# Altium schematic sheet P09_USB HOST_USB OTG.SchDoc
size 594 x 420 mm
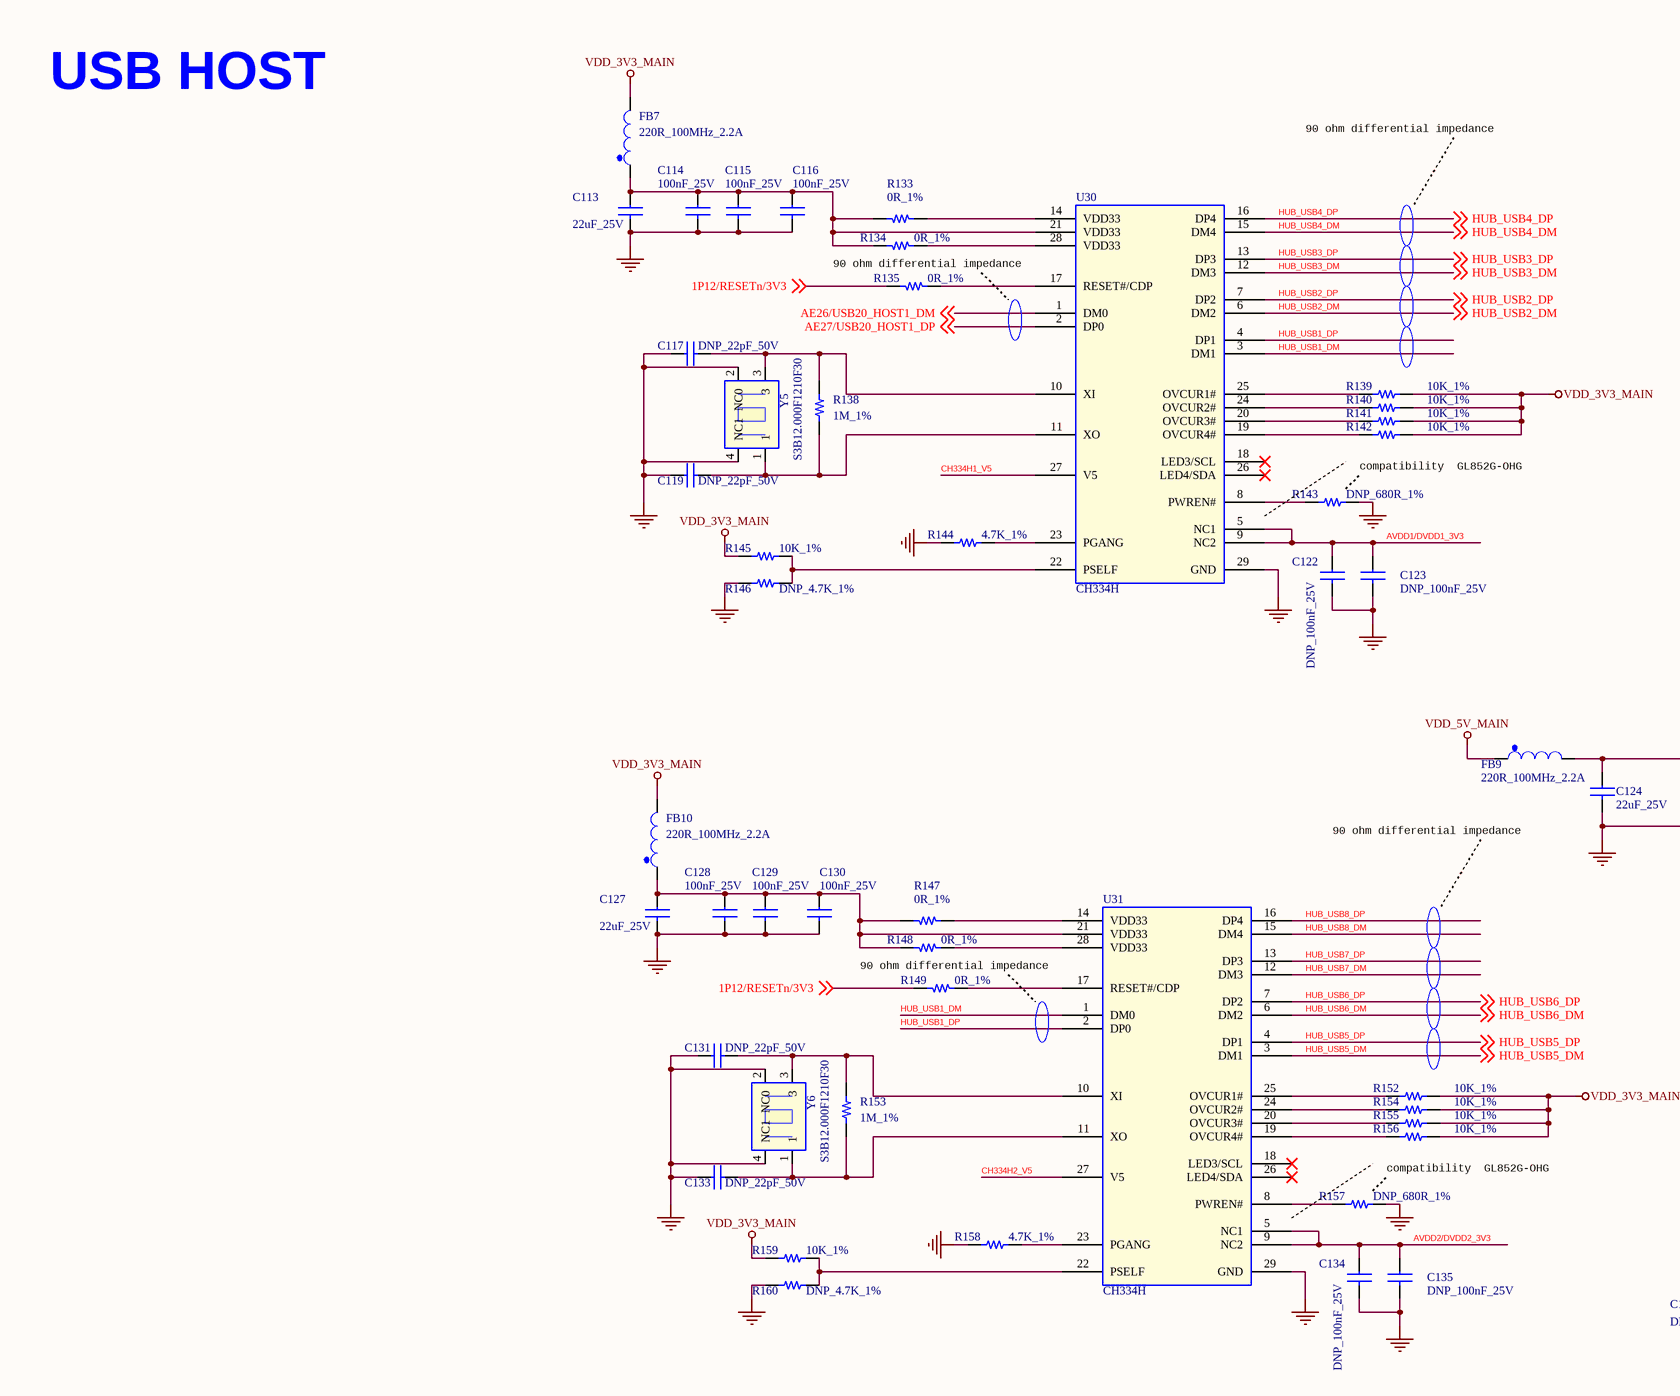
[diagram p0: P09_USB HOST_USB OTG.SchDoc, top left]
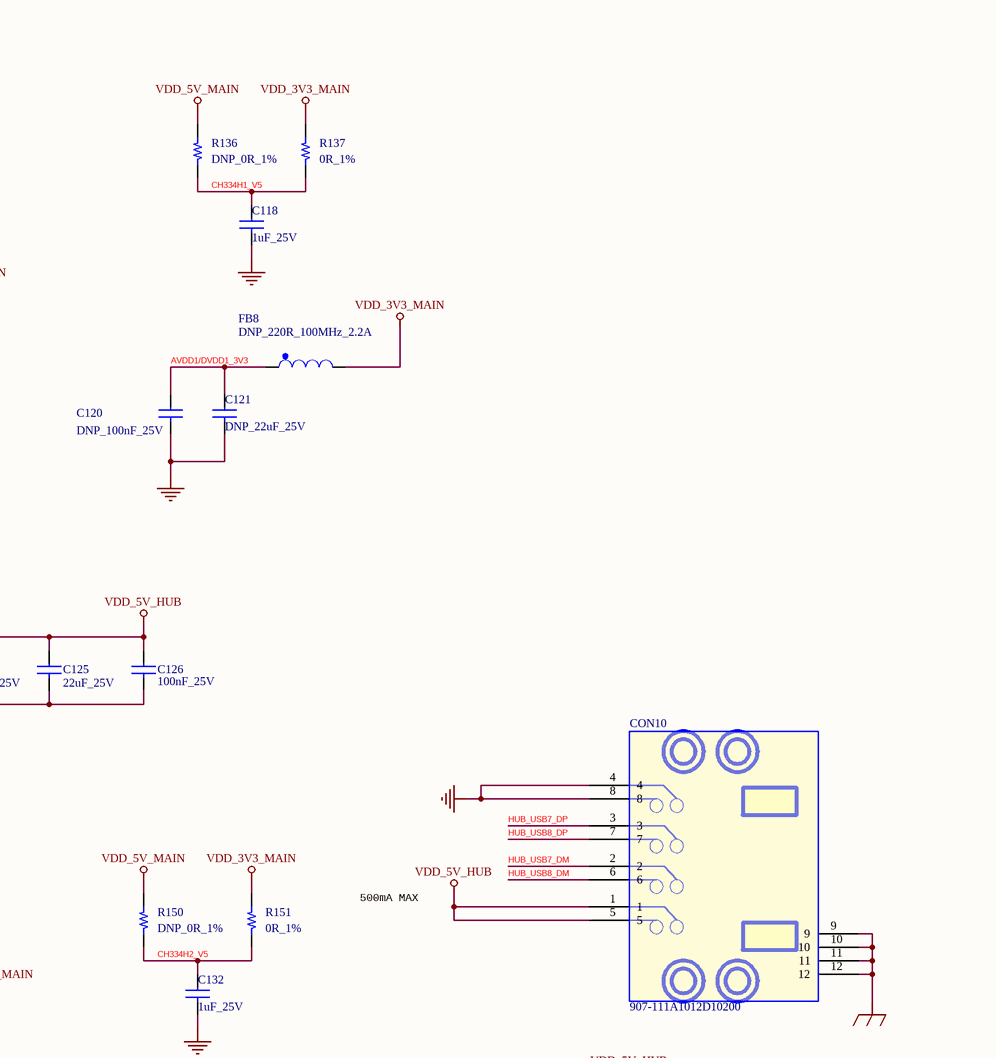
[diagram p1: P09_USB HOST_USB OTG.SchDoc, top right]
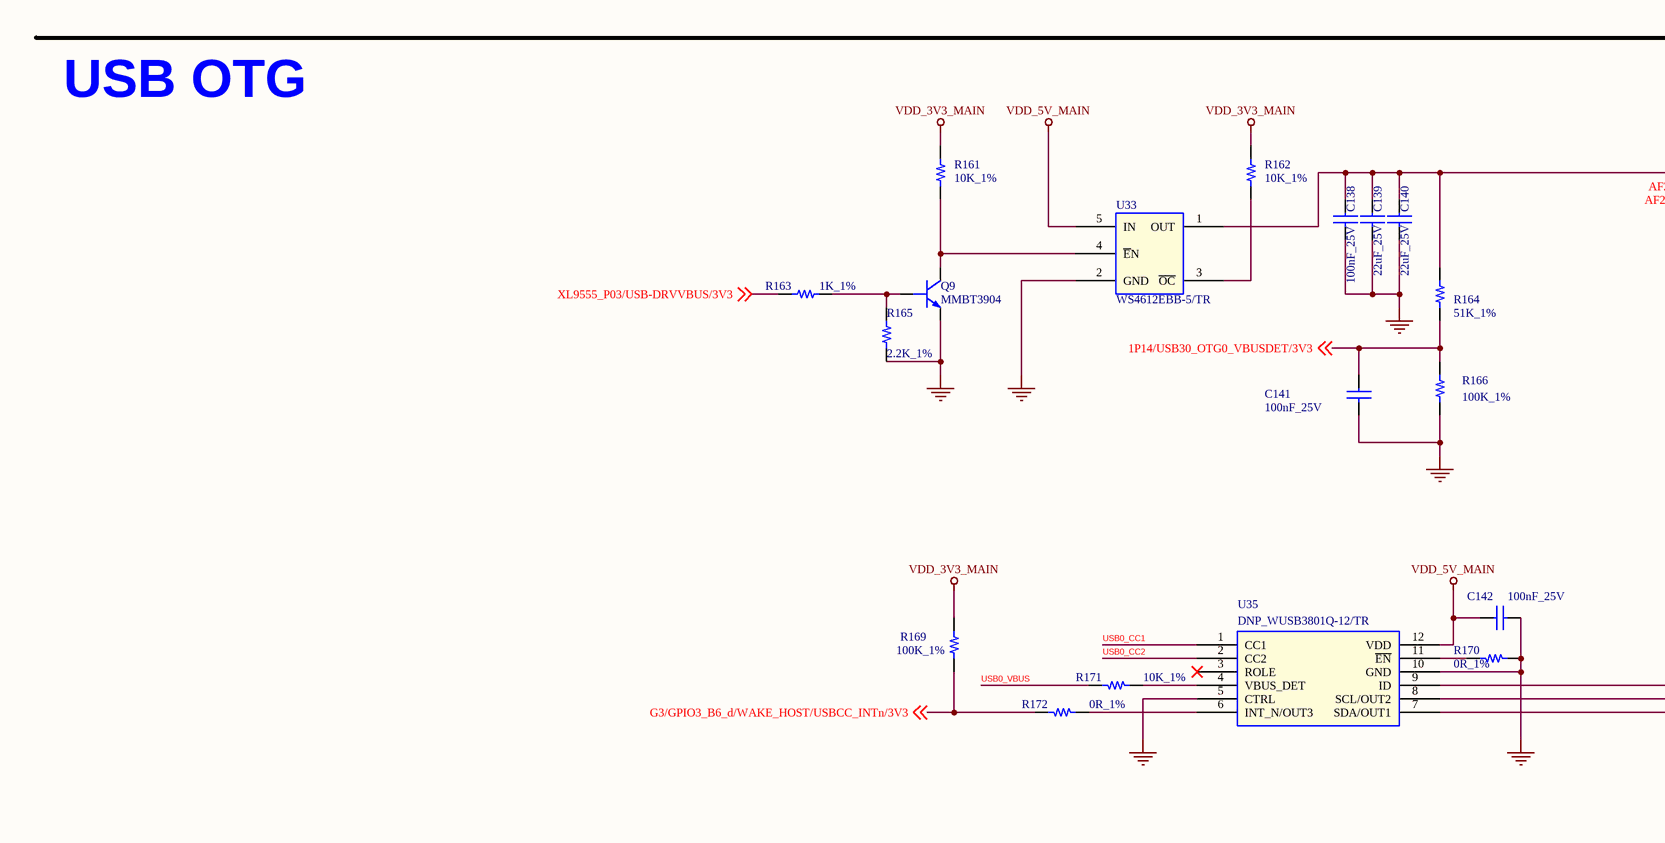
[diagram p2: P09_USB HOST_USB OTG.SchDoc, bottom left]
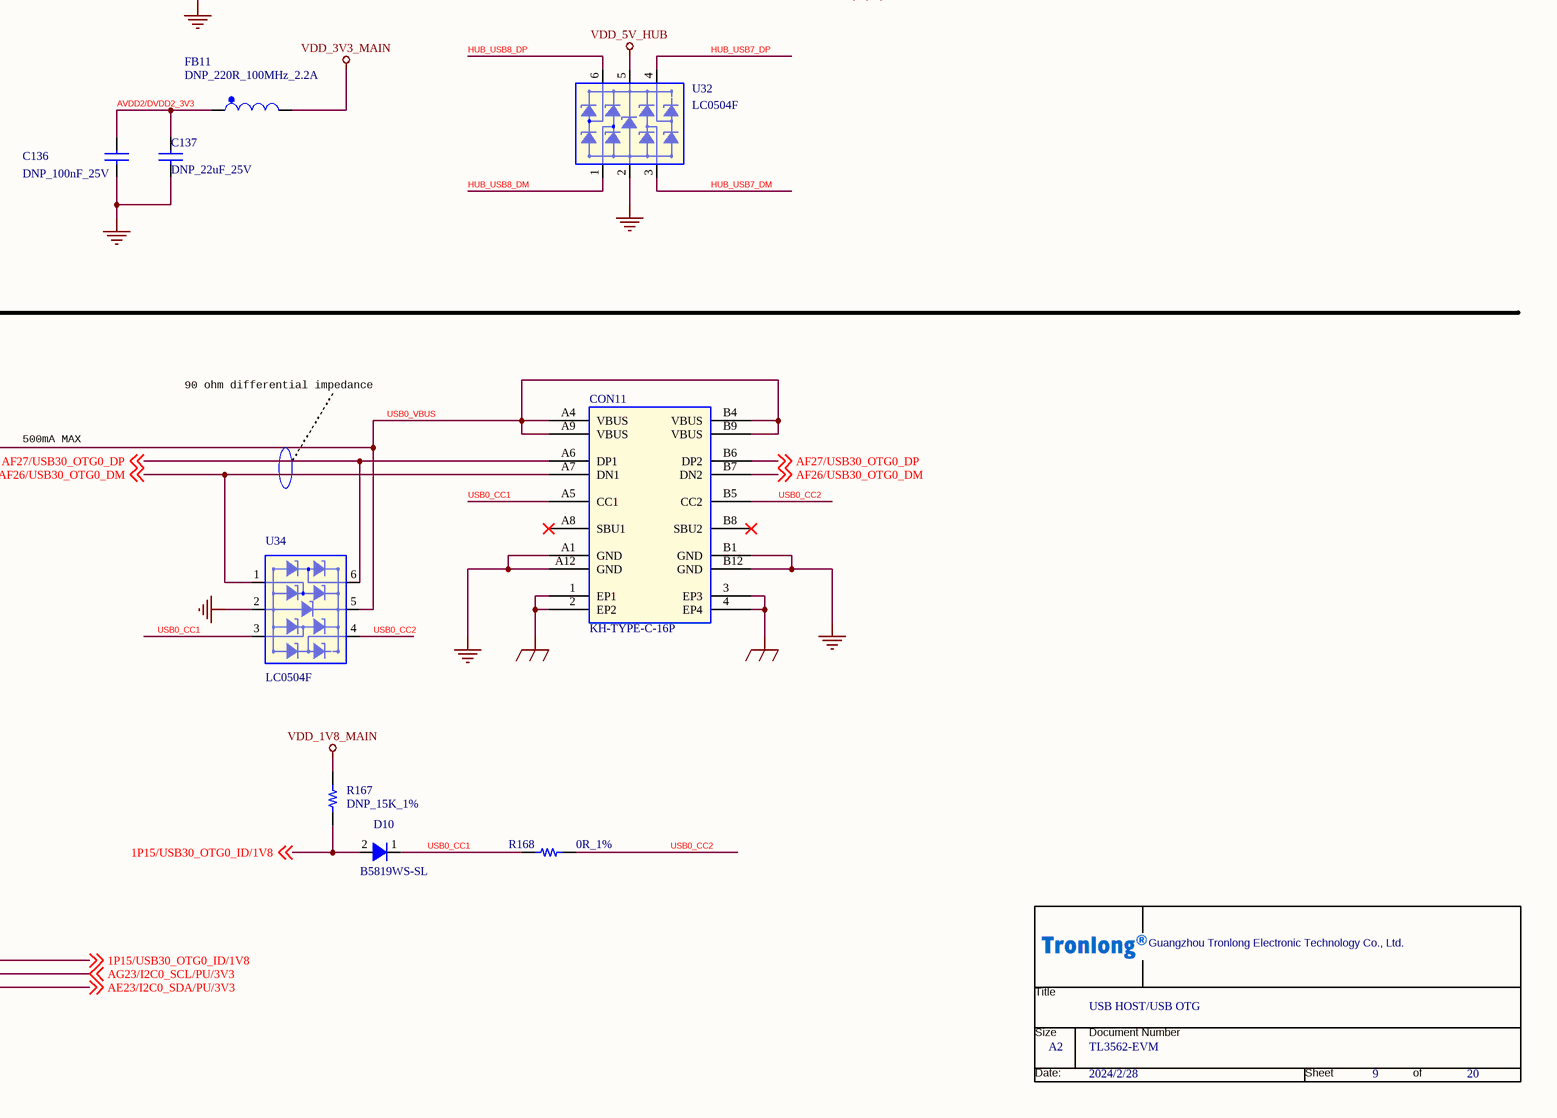
[diagram p3: P09_USB HOST_USB OTG.SchDoc, bottom right]

## Parts
*  Page Count: 20  Page Number: 9  Page Size: A2  OrgName: Guangzhou Tronlong Electronic Technology Co., Ltd.  Title: USB HOST/USB OTG  Doc: TL3562-EVM  Page Modify Date: 2024/2/28  (hidden comment: Tronlong_TITTLE_20211115)  (graphical)
C113  22uF_25V  [C0805]
C114  100nF_25V  [C0402]
C115  100nF_25V  [C0402]
C116  100nF_25V  [C0402]
C117  DNP_22pF_50V  [C0603]
C118  1uF_25V  [C0603]
C119  DNP_22pF_50V  [C0603]
C120  DNP_100nF_25V  [C0402]
C121  DNP_22uF_25V  [C0805]
C122  DNP_100nF_25V  [C0402]
C123  DNP_100nF_25V  [C0402]
C124  22uF_25V  [C0805]
C125  22uF_25V  [C0805]
C126  100nF_25V  [C0402]
C127  22uF_25V  [C0805]
C128  100nF_25V  [C0402]
C129  100nF_25V  [C0402]
C130  100nF_25V  [C0402]
C131  DNP_22pF_50V  [C0603]
C132  1uF_25V  [C0603]
C133  DNP_22pF_50V  [C0603]
C134  DNP_100nF_25V  [C0402]
C135  DNP_100nF_25V  [C0402]
C136  DNP_100nF_25V  [C0402]
C137  DNP_22uF_25V  [C0805]
C138  100nF_25V  [C0402]
C139  22uF_25V  [C0805]
C140  22uF_25V  [C0805]
C141  100nF_25V  [C0402]
C142  100nF_25V  [C0402]
CON10  907-111A1012D10200  [CON_USBA_DUAL]
CON11  KH-TYPE-C-16P  [TYPE-C_16P_90_SMD]
D10  B5819WS-SL  [SOD-323]
FB7  220R_100MHz_2.2A  [L0603]
FB8  DNP_220R_100MHz_2.2A  [L0603]
FB9  220R_100MHz_2.2A  [L0603]
FB10  220R_100MHz_2.2A  [L0603]
FB11  DNP_220R_100MHz_2.2A  [L0603]
Q9  MMBT3904  [SOT23-3_DBZ3]
R133  0R_1%  [R0402]
R134  0R_1%  [R0402]
R135  0R_1%  [R0402]
R136  DNP_0R_1%  [R0603]
R137  0R_1%  [R0603]
R138  1M_1%  [R0603]
R139  10K_1%  [R0402]
R140  10K_1%  [R0402]
R141  10K_1%  [R0402]
R142  10K_1%  [R0402]
R143  DNP_680R_1%  [R0603]
R144  4.7K_1%  [R0402]
R145  10K_1%  [R0402]
R146  DNP_4.7K_1%  [R0402]
R147  0R_1%  [R0402]
R148  0R_1%  [R0402]
R149  0R_1%  [R0402]
R150  DNP_0R_1%  [R0603]
R151  0R_1%  [R0603]
R152  10K_1%  [R0402]
R153  1M_1%  [R0603]
R154  10K_1%  [R0402]
R155  10K_1%  [R0402]
R156  10K_1%  [R0402]
R157  DNP_680R_1%  [R0603]
R158  4.7K_1%  [R0402]
R159  10K_1%  [R0402]
R160  DNP_4.7K_1%  [R0402]
R161  10K_1%  [R0402]
R162  10K_1%  [R0402]
R163  1K_1%  [R0402]
R164  51K_1%  [R0402]
R165  2.2K_1%  [R0603]
R166  100K_1%  [R0402]
R167  DNP_15K_1%  [R0402]
R168  0R_1%  [R0402]
R169  100K_1%  [R0402]
R170  0R_1%  [R0402]
R171  10K_1%  [R0402]
R172  0R_1%  [R0402]
U30  CH334H  [QFN28_5x5]
U31  CH334H  [QFN28_5x5]
U32  LC0504F  [SOT363]
U33  WS4612EBB-5/TR  [SOT23-5]
U34  LC0504F  [SOT363]
U35  DNP_WUSB3801Q-12/TR  [QFN1616-12L]
Y5  S3B12.000F1210F30  [SMD_3225]
Y6  S3B12.000F1210F30  [SMD_3225]

## Nets
EGND: CON10.9 CON10.10 CON10.11 CON10.12 CON11.1(EP1) CON11.2(EP2) CON11.3(EP3) CON11.4(EP4)
GND: C113.2 C114.2 C115.2 C116.2 C117.1 C118.2 C119.1 C120.2 C121.2 C122.2 C123.2 C124.2 C125.2 C126.2 C127.2 C128.2 C129.2 C130.2 C131.1 C132.2 C133.1 C134.2 C135.2 C136.2 C137.2 C138.2 C139.2 C140.2 C141.2 C142.2 CON10.4 CON10.8 CON11.A1(GND) CON11.A12(GND) CON11.B1(GND) CON11.B12(GND) Q9.2(E) R143.2 R144.2 R146.2 R157.2 R158.2 R160.2 R165.1 R166.1 R170.1 U30.29(GND) U31.29(GND) U32.2 U33.2(GND) U34.2 U35.5(CTRL) U35.10(GND) Y5.2(NC0) Y5.4(NC1) Y6.2(NC0) Y6.4(NC1)
VDD_1V8_MAIN: R167.1
VDD_3V3_MAIN: FB7.2 FB8.2 FB10.2 FB11.2 R137.2 R139.2 R140.2 R141.2 R142.2 R145.1 R151.2 R152.2 R154.2 R155.2 R156.2 R159.1 R161.1 R162.2 R169.1
VDD_5V_HUB: C124.1 C125.1 C126.1 CON10.1 CON10.5 FB9.2 U32.5
VDD_5V_MAIN: C142.1 FB9.1 R136.2 R150.2 U33.5(IN) U35.12(VDD)
1P12/RESETn/3V3: R135.2 R149.2 ; off-sheet 1P12/RESETn/3V3
1P14/USB30_OTG0_VBUSDET/3V3: C141.1 R164.1 R166.2 ; off-sheet 1P14/USB30_OTG0_VBUSDET/3V3
1P15/USB30_OTG0_ID/1V8: D10.2(Cathode) R167.2 U35.9(ID) ; off-sheet 1P15/USB30_OTG0_ID/1V8
AE23/I2C0_SDA/PU/3V3: U35.7(SDA/OUT1) ; off-sheet AE23/I2C0_SDA/PU/3V3
AE26/USB20_HOST1_DM: U30.1(DM0) ; off-sheet AE26/USB20_HOST1_DM
AE27/USB20_HOST1_DP: U30.2(DP0) ; off-sheet AE27/USB20_HOST1_DP
AF26/USB30_OTG0_DM: CON11.A7(DN1) CON11.B7(DN2) U34.1 ; off-sheet AF26/USB30_OTG0_DM
AF27/USB30_OTG0_DP: CON11.A6(DP1) CON11.B6(DP2) U34.6 ; off-sheet AF27/USB30_OTG0_DP
AG23/I2C0_SCL/PU/3V3: U35.8(SCL/OUT2) ; off-sheet AG23/I2C0_SCL/PU/3V3
AVDD1/DVDD1_3V3: C120.1 C121.1 C122.1 C123.1 FB8.1 U30.5(NC1) U30.9(NC2)
AVDD2/DVDD2_3V3: C134.1 C135.1 C136.1 C137.1 FB11.1 U31.5(NC1) U31.9(NC2)
CH334H1_V5: C118.1 R136.1 R137.1 U30.27(V5)
CH334H2_V5: C132.1 R150.1 R151.1 U31.27(V5)
G3/GPIO3_B6_d/WAKE_HOST/USBCC_INTn/3V3: R169.2 R172.2 ; off-sheet G3/GPIO3_B6_d/WAKE_HOST/USBCC_INTn/3V3
HUB_USB1_DM: U30.3(DM1) U31.1(DM0)
HUB_USB1_DP: U30.4(DP1) U31.2(DP0)
HUB_USB2_DM: U30.6(DM2) ; off-sheet HUB_USB2_DM
HUB_USB2_DP: U30.7(DP2) ; off-sheet HUB_USB2_DP
HUB_USB3_DM: U30.12(DM3) ; off-sheet HUB_USB3_DM
HUB_USB3_DP: U30.13(DP3) ; off-sheet HUB_USB3_DP
HUB_USB4_DM: U30.15(DM4) ; off-sheet HUB_USB4_DM
HUB_USB4_DP: U30.16(DP4) ; off-sheet HUB_USB4_DP
HUB_USB5_DM: U31.3(DM1) ; off-sheet HUB_USB5_DM
HUB_USB5_DP: U31.4(DP1) ; off-sheet HUB_USB5_DP
HUB_USB6_DM: U31.6(DM2) ; off-sheet HUB_USB6_DM
HUB_USB6_DP: U31.7(DP2) ; off-sheet HUB_USB6_DP
HUB_USB7_DM: CON10.2 U31.12(DM3) U32.3
HUB_USB7_DP: CON10.3 U31.13(DP3) U32.4
HUB_USB8_DM: CON10.6 U31.15(DM4) U32.1
HUB_USB8_DP: CON10.7 U31.16(DP4) U32.6
USB0_CC1: CON11.A5(CC1) D10.1(Anode) R168.2 U34.3 U35.1(CC1)
USB0_CC2: CON11.B5(CC2) R168.1 U34.4 U35.2(CC2)
USB0_VBUS: C138.1 C139.1 C140.1 CON11.A4(VBUS) CON11.A9(VBUS) CON11.B4(VBUS) CON11.B9(VBUS) R164.2 R171.2 U33.1(OUT) U34.5
XL9555_P03/USB-DRVVBUS/3V3: R163.2 ; off-sheet XL9555_P03/USB-DRVVBUS/3V3
NetC113_1: C113.1 C114.1 C115.1 C116.1 FB7.1 R133.1 R134.1 U30.21(VDD33)
NetC117_2: C117.2 R138.1 U30.10(XI) Y5.3
NetC119_2: C119.2 R138.2 U30.11(XO) Y5.1
NetC127_1: C127.1 C128.1 C129.1 C130.1 FB10.1 R147.1 R148.1 U31.21(VDD33)
NetC131_2: C131.2 R153.1 U31.10(XI) Y6.3
NetC133_2: C133.2 R153.2 U31.11(XO) Y6.1
NetQ9_1: Q9.1(B) R163.1 R165.2
NetQ9_3: Q9.3(C) R161.2 U33.4(~{E}N)
NetR133_2: R133.2 U30.14(VDD33)
NetR134_2: R134.2 U30.28(VDD33)
NetR135_1: R135.1 U30.17(RESET#/CDP)
NetR139_1: R139.1 U30.25(OVCUR1#)
NetR140_1: R140.1 U30.24(OVCUR2#)
NetR141_1: R141.1 U30.20(OVCUR3#)
NetR142_1: R142.1 U30.19(OVCUR4#)
NetR143_1: R143.1 U30.8(PWREN#)
NetR144_1: R144.1 U30.23(PGANG)
NetR145_2: R145.2 R146.1 U30.22(PSELF)
NetR147_2: R147.2 U31.14(VDD33)
NetR148_2: R148.2 U31.28(VDD33)
NetR149_1: R149.1 U31.17(RESET#/CDP)
NetR152_1: R152.1 U31.25(OVCUR1#)
NetR154_1: R154.1 U31.24(OVCUR2#)
NetR155_1: R155.1 U31.20(OVCUR3#)
NetR156_1: R156.1 U31.19(OVCUR4#)
NetR157_1: R157.1 U31.8(PWREN#)
NetR158_1: R158.1 U31.23(PGANG)
NetR159_2: R159.2 R160.1 U31.22(PSELF)
NetR162_1: R162.1 U33.3(~{OC})
NetR170_2: R170.2 U35.11(~{EN})
NetR171_1: R171.1 U35.4(VBUS_DET)
NetR172_1: R172.1 U35.6(INT_N/OUT3)

Not connected (* = marked no-connect by the designer): CON11 A8(SBU1)* B8(SBU2)*; U30 18(LED3/SCL)* 26(LED4/SDA)*; U31 18(LED3/SCL)* 26(LED4/SDA)*; U35 3(ROLE)*

## Notes on the sheet
- USB HOST
- 90 ohm differential impedance
- compatibility  GL852G-OHG
- 500mA MAX
- USB OTG
- (in symbol Tronlong_TITTLE_20211115) Title; Size; Document Number; Date:; Sheet; of

## Library data of the parts
* = Tronlong_TITTLE_20211115: RevCode: A?; Page Create Date: March  8, 1995
C113 = CAP NP_Dup3: 贴片陶瓷电容,22uF,20%,25V,X5R; Manufacturer Character: 中国大陆; room: USB HUB; Operation Temperature（℃）: -55~85℃; As-Welded: /; Temperature: -55~125℃; PCB Footprint: C0805
C114 C116 C129 = CAP NP_Dup3: 贴片陶瓷电容,100nF,10%,25V,X5R; Manufacturer Character: 中国大陆; As-Welded: /; Operation Temperature（℃）: -55~85℃; room: USB HUB; Temperature: -55~125℃; PCB Footprint: C0402
C115 C126 C128 C130 = CAP NP_Dup3: 贴片陶瓷电容,100nF,10%,25V,X5R; Manufacturer Character: 中国大陆; As-Welded: /; room: USB HUB; Operation Temperature（℃）: -55~85℃; Temperature: -55~125℃; PCB Footprint: C0402
C117 C119 = CAP NP_Dup3: 贴片陶瓷电容,22pF,5%,50V,COG; Manufacturer Character: 中国大陆; Operation Temperature（℃）: -55~125℃; As-Welded: DNP; room: USB HUB; Temperature: -55~125℃; PCB Footprint: C0603
C118 C132 = CAP NP_Dup3: 贴片陶瓷电容,1uF,10%,25V,X5R; Manufacturer Character: 中国大陆; As-Welded: /; Operation Temperature（℃）: -55~85℃; room: USB HUB; PCB Footprint: C0603
C120 C122 C136 = CAP NP_Dup3: 100nF,10%,C0402,25V; Manufacturer Character: 中国大陆; Operation Temperature（℃）: -40~85℃; As-Welded: DNP; room: USB HUB; Temperature: -55~125℃; PCB Footprint: C0402
C121 = CAP NP_Dup3: 贴片陶瓷电容,22uF,10%,16V,X5R; Manufacturer Character: 中国大陆; room: USB HUB; As-Welded: DNP; Operation Temperature（℃）: -55~85℃; Temperature: -55~125℃; PCB Footprint: C0805
C123 C134 C135 = CAP NP_Dup3: 100nF,10%,C0402,25V; Manufacturer Character: 中国大陆; room: USB HUB; As-Welded: DNP; Operation Temperature（℃）: -40~85℃; Temperature: -55~125℃; PCB Footprint: C0402
C124 C125 C127 = CAP NP_Dup3: 贴片陶瓷电容,22uF,20%,25V,X5R; Manufacturer Character: 中国大陆; Operation Temperature（℃）: -55~85℃; room: USB HUB; As-Welded: /; Temperature: -55~125℃; PCB Footprint: C0805
C131 C133 = CAP NP_Dup3: 贴片陶瓷电容,22pF,5%,50V,COG; Manufacturer Character: 中国大陆; room: USB HUB; As-Welded: DNP; Operation Temperature（℃）: -55~125℃; Temperature: -55~125℃; PCB Footprint: C0603
C137 = CAP NP_Dup3: 贴片陶瓷电容,22uF,10%,16V,X5R; Manufacturer Character: 中国大陆; Operation Temperature（℃）: -55~85℃; As-Welded: DNP; room: USB HUB; Temperature: -55~125℃; PCB Footprint: C0805
C138 = CAP NP_Dup1: 贴片陶瓷电容,100nF,10%,25V,X5R; Manufacturer Character: 中国大陆; As-Welded: /; Operation Temperature（℃）: -55~85℃; room: DRDUSB; Temperature: -55~125℃; PCB Footprint: C0402
C139 C140 = CAP NP_Dup1: 贴片陶瓷电容,22uF,20%,25V,X5R; Manufacturer Character: 中国大陆; Operation Temperature（℃）: -55~85℃; room: DRDUSB; As-Welded: /; Temperature: -55~125℃; PCB Footprint: C0805
C141 = CAP NP_Dup1: 贴片陶瓷电容,100nF,10%,25V,X5R; Manufacturer Character: 中国大陆; Operation Temperature（℃）: -55~85℃; As-Welded: /; room: DRDUSB; Temperature: -55~125℃; PCB Footprint: C0402
C142 = CAP NP_Dup1: 贴片陶瓷电容,100nF,10%,25V,X5R; Manufacturer Character: 中国大陆; As-Welded: /; Operation Temperature（℃）: -55~85℃; room: USB HUB; Temperature: -55~125℃; PCB Footprint: C0402
CON10 = DOUBLE USB A TYPE: USB-A-双层座,8PIN,90度,母座,插件; Manufacturer PartNumber: FUS208-FDBW3K; Manufacturer: 深圳特思嘉工业电子有限公司（TXGA）; Manufacturer Character: 中国大陆; Operation Temperature（℃）: -40~85℃; room: USB HUB; As-Welded: /; PCB Footprint: CON_USBA_DUAL
CON11 = usb 3_0.0 type-c female: Type-C 母座 90度 16 Pin; Manufacturer Character: 中国大陆; Manufacturer: 深圳市金航标电子有限公司(kinghelm); Operation Temperature（℃）: -40~85℃; room: 10; As-Welded: /; PCB Footprint: TYPE-C_16P_90_SMD; Manufacturer PartNumber: KH-TYPE-C-16P
D10 = Diode200mA250V_2: 肖特基二极管,VR=40V,IF=1A,VF=0.6V@1A; TIIntPartnumber: 1E0013; MfrNum: MMSD103T1G; Mfr: On Semiconductor; Manufacturer Character: 中国大陆; Manufacturer: 江苏长晶科技有限公司（JSCJ）; DescriptiveText: Diode 200mA 250V 1.25V Forward Drop; PCB Footprint: smd123; Cost10K: 0.07; Cost100: 0.23; Vendor: Digikey; Operation Temperature（℃）: -55~125℃; As-Welded: /; PartName: Diode200mA250V; Descriptive_Text: Diode 200mA 250V 1.25V Forward Drop; Temperature: -40~125℃; Manufacturer PartNumber: B5819WS-SL
FB7 = FERRITE BEAD_Dup1: 磁珠,50mΩ,2.2A,220R@100MHz; Manufacturer Character: 中国大陆; Manufacturer: 深圳顺络电子股份有限公司（Sunlord）; Manufacturer PartNumber: UPZ1608U221-2R2TF; room: USB HUB; Operation Temperature（℃）: -55~125℃; As-Welded: /; PCB Footprint: L0603; Temperature: -55~+125(Ta)
FB8 FB11 = FERRITE BEAD_Dup1: 磁珠,50mΩ,2.2A,220R@100MHz; Manufacturer Character: 中国大陆; Manufacturer: 深圳顺络电子股份有限公司（Sunlord）; Manufacturer PartNumber: UPZ1608U221-2R2TF; room: USB HUB; As-Welded: DNP; Operation Temperature（℃）: -55~125℃; PCB Footprint: L0603; Temperature: -55~125℃
FB9 FB10 = FERRITE BEAD_Dup1: 磁珠,50mΩ,2.2A,220R@100MHz; Manufacturer PartNumber: UPZ1608U221-2R2TF; Manufacturer: 深圳顺络电子股份有限公司（Sunlord）; Manufacturer Character: 中国大陆; Operation Temperature（℃）: -55~125℃; room: USB HUB; As-Welded: /; PCB Footprint: L0603; Temperature: -55~+125(Ta)
Q9 = MMBT3904/SOT: BJT,NPN,Vceo=40V,Ic=200mA,fT=300MHz,PD=200mW; Manufacturer Character: 中国大陆; Manufacturer: 江苏长晶科技有限公司（JSCJ）; Operation Temperature（℃）: -55~150℃; As-Welded: /; Temperature: -55~150℃; Manufacturer PartNumber: MMBT3904; PCB Footprint: SOT23-3_DBZ3
R133-R135 R147-R149 = Resistor_Dup3: 0R,±1%,R0402,≥1/16W; Manufacturer Character: 中国大陆; CLASS: DISCRETE; As-Welded: /; Operation Temperature（℃）: -55~155℃; PCB Footprint: R0402
R136 R150 = Resistor_Dup3: 贴片电阻,0R,±1%,1/10W; Manufacturer Character: 中国大陆; CLASS: DISCRETE; As-Welded: DNP; Operation Temperature（℃）: -55~155℃; PCB Footprint: R0603
R137 R151 = Resistor_Dup3: 0R,±1%,R0603,≥1/10W; Manufacturer Character: 中国大陆; CLASS: DISCRETE; As-Welded: /; Operation Temperature（℃）: -55~155℃; Temperature: –55~155℃; PCB Footprint: R0603
R138 = Resistor_Dup3: 贴片电阻,1M,±1%,1/10W; Manufacturer Character: 中国大陆; CLASS: DISCRETE; As-Welded: /; Operation Temperature（℃）: -55~155℃; room: USB HUB; PCB Footprint: R0603
R139-R142 R145 = Resistor_Dup3: 贴片电阻,10K,±1%,1/16W; Manufacturer Character: 中国大陆; CLASS: DISCRETE; Operation Temperature（℃）: -55~155℃; room: USB HUB; As-Welded: /; Temperature: –55~155℃; PCB Footprint: R0402
R143 = Resistor_Dup3: 贴片电阻,680R,±1%,1/10W; Manufacturer Character: 中国大陆; CLASS: DISCRETE; room: USB HUB; As-Welded: DNP; Operation Temperature（℃）: -55~155℃; Temperature: -55~155℃; PCB Footprint: R0603
R144 R158 = Resistor_Dup3: 贴片电阻,4.7K,±1%,1/16W; Manufacturer Character: 中国大陆; CLASS: DISCRETE; As-Welded: /; Operation Temperature（℃）: -55~155℃; Temperature: -55~155℃; PCB Footprint: R0402
R146 = Resistor_Dup3: 贴片电阻,4.7K,±1%,1/16W; Manufacturer Character: 中国大陆; CLASS: DISCRETE; Operation Temperature（℃）: -55~155℃; As-Welded: DNP; PCB Footprint: R0402; Temperature: -55~155℃
R152 R154-R156 R159 = Resistor_Dup3: 贴片电阻,10K,±1%,1/16W; Manufacturer Character: 中国大陆; CLASS: DISCRETE; room: USB HUB; Operation Temperature（℃）: -55~155℃; As-Welded: /; Temperature: –55~155℃; PCB Footprint: R0402
R153 = Resistor_Dup3: 贴片电阻,1M,±1%,1/10W; Manufacturer Character: 中国大陆; CLASS: DISCRETE; As-Welded: /; room: USB HUB; Operation Temperature（℃）: -55~155℃; PCB Footprint: R0603
R157 = Resistor_Dup3: 贴片电阻,680R,±1%,1/10W; Manufacturer Character: 中国大陆; CLASS: DISCRETE; Operation Temperature（℃）: -55~155℃; As-Welded: DNP; room: USB HUB; Temperature: -55~155℃; PCB Footprint: R0603
R160 = Resistor_Dup3: 贴片电阻,4.7K,±1%,1/16W; Manufacturer Character: 中国大陆; CLASS: DISCRETE; As-Welded: DNP; Operation Temperature（℃）: -55~155℃; PCB Footprint: R0402; Temperature: -55~155℃
R161 = R 1%: 贴片电阻,10K,±1%,1/16W; Manufacturer Character: 中国大陆; Characteristic: 0402 1/16W +/-1%; CLASS: DISCRETE; Operation Temperature（℃）: -55~155℃; As-Welded: /; room: DRDUSB; Temperature: –55~155℃; PCB Footprint: R0402
R162 = R 1%: 贴片电阻,10K,±1%,1/16W; Manufacturer Character: 中国大陆; Characteristic: 0402 1/16W +/-1%; CLASS: DISCRETE; room: DRDUSB; Operation Temperature（℃）: -55~155℃; As-Welded: /; Temperature: –55~155℃; PCB Footprint: R0402
R163 = Resistor_Dup3: 贴片电阻,1K,±1%,1/16W; Manufacturer Character: 中国大陆; CLASS: DISCRETE; Operation Temperature（℃）: -55~155℃; As-Welded: /; PCB Footprint: R0402
R164 = R 1%: 贴片电阻,51K,±1%,1/16W; Manufacturer Character: 中国大陆; Mistral Part No: 110009031036-R; Mfr_name: PANASONIC-ECG; Mfr_part_number: ERJ-2RNF6981V; Part_type: RESISTORS\FIXED; Characteristic: 0402 1/16W +/-1%; CLASS: DISCRETE; Operation Temperature（℃）: -55~155℃; Project: TELEMETRY ENCODER; Customs_HS_Code: 85332119; Custom_Duty: 15%; As-Welded: /; Temperature: -55~155℃; Tolerance: 1%; Package: 0402; Distributor_name: NA; Distributor_part_number: NA; Height: 0.40MM; Datasheet: Y:\MIS_DATABASE\DATASHEETS\RESISTORS\PAN_ERJ.PDF; Crtd /date: MAZHAR/090807; PCB Footprint: R0402
R165 = Resistor_Dup3: 贴片电阻,2.2K,±1%,1/10W; Manufacturer Character: 中国大陆; CLASS: DISCRETE; As-Welded: /; Operation Temperature（℃）: -55~155℃; PCB Footprint: R0603
R166 = R 1%: 贴片电阻,100K,±1%,1/16W; Manufacturer Character: 中国大陆; Characteristic: 0402 1/16W +/-1%; CLASS: DISCRETE; Operation Temperature（℃）: -55~155℃; As-Welded: /; room: USB HUB; PCB Footprint: R0402; Temperature: -55~155℃
R167 = R 1%: 贴片电阻,15K,±1%,1/16W; Manufacturer Character: 中国大陆; Characteristic: 0402 1/16W +/-1%; CLASS: DISCRETE; Operation Temperature（℃）: -55~155℃; room: DRDUSB; As-Welded: DNP; PCB Footprint: R0402; Temperature: -55~125℃
R168 = 10_R_0: 0R,±1%,R0402,≥1/16W; Manufacturer Character: 中国大陆; CLASS: DISCRETE; room: ecat1; Operation Temperature（℃）: -55~155℃; As-Welded: /; Temperature: -55~155℃; PCB Footprint: R0402
R169 = R 1%: 贴片电阻,100K,±1%,1/16W; Manufacturer Character: 中国大陆; Characteristic: 0402 1/16W +/-1%; CLASS: DISCRETE; As-Welded: /; Operation Temperature（℃）: -55~155℃; room: DRDUSB; PCB Footprint: R0402; Temperature: -55~125℃
R170 R172 = R 1%: 0R,±1%,R0402,≥1/16W; Manufacturer Character: 中国大陆; Characteristic: 0402 1/16W +/-1%; CLASS: DISCRETE; As-Welded: /; room: USB HUB; Operation Temperature（℃）: -55~155℃; Temperature: -55~125℃; PCB Footprint: R0402
R171 = R 1%: 贴片电阻,10K,±1%,1/16W; Manufacturer Character: 中国大陆; Characteristic: 0402 1/16W +/-1%; CLASS: DISCRETE; room: USB HUB; Operation Temperature（℃）: -55~155℃; As-Welded: /; Temperature: -55~125℃; PCB Footprint: R0402
U30 = GL852GT_1: USB HUB控制器; Manufacturer: 南京沁恒微电子股份有限公司（WCH）; Manufacturer Character: 中国大陆; Operation Temperature（℃）: -40~85℃; room: USB HUB; As-Welded: /; PCB Footprint: QFN28_5x5; Temperature: -40~85℃; Manufacturer PartNumber: CH334H
U31 = GL852GT_1: USB HUB控制器; Manufacturer Character: 中国大陆; Manufacturer: 南京沁恒微电子股份有限公司（WCH）; room: USB HUB; Operation Temperature（℃）: -40~85℃; As-Welded: /; PCB Footprint: QFN28_5x5; Manufacturer PartNumber: CH334H; Temperature: -40~85℃
U32 = PRTR5V0U4Y: ESD二极管,VRWM=5V,VBR=6V,四组,单向,8KV,15KV; Manufacturer Character: 中国大陆; Manufacturer: 上海雷卯电子科技有限公司（Leiditech）; room: DRDUSB; Operation Temperature（℃）: -55~125℃; As-Welded: /; PCB Footprint: SOT363; Temperature: -40~85℃; Manufacturer PartNumber: LC0504F
U33 = TPS2041BDGN_0: 限流配电开关,2.5V~5.5V,1.4A; Manufacturer Character: 中国大陆; Manufacturer: 上海韦尔半导体股份有限公司（WILLSEMI）; Operation Temperature（℃）: -40~85℃; room: DRDUSB; As-Welded: /; Temperature: -40~85℃; Manufacturer PartNumber: WS4612EBB-5/TR; PCB Footprint: SOT23-5
U34 = PRTR5V0U4Y: ESD二极管,VRWM=5V,VBR=6V,四组,单向,8KV,15KV; Manufacturer Character: 中国大陆; Manufacturer: 上海雷卯电子科技有限公司（Leiditech）; Operation Temperature（℃）: -55~125℃; room: DRDUSB; As-Welded: /; Manufacturer PartNumber: LC0504F; Temperature: -40~85℃; PCB Footprint: SOT363
U35 = TPS54286PWP_2: USB Type-C配置通道适配器芯片; Manufacturer: 上海韦尔半导体股份有限公司（WILLSEMI）; Manufacturer Character: 中国大陆; Operation Temperature（℃）: -40~125℃; As-Welded: DNP; PCB Footprint: QFN1616-12L; Manufacturer PartNumber: WUSB3801Q-12/TR
Y5 = CRYSTAL: 四脚无源晶振,12MHz,±10ppm,12pF,100Ω,±30ppm; Manufacturer: 深圳市星通时频电子有限公司公司（JSCJ）; Manufacturer Character: 中国大陆; Operation Temperature（℃）: -40~85℃; room: USB HUB; As-Welded: /; PCB Footprint: SMD_3225; Temperature: -40~85℃; Manufacturer PartNumber: S3B12.000F1210F30
Y6 = CRYSTAL: 四脚无源晶振,12MHz,±10ppm,12pF,100Ω,±30ppm; Manufacturer Character: 中国大陆; Manufacturer: 深圳市星通时频电子有限公司公司（JSCJ）; room: USB HUB; Operation Temperature（℃）: -40~85℃; As-Welded: /; PCB Footprint: SMD_3225; Manufacturer PartNumber: S3B12.000F1210F30; Temperature: -40~85℃